# EasyEDA schematic YM2151 & STM32F0.json
TITLE: STM32F0 & YM2151; REV: 1.0.1; Date: 2020-01-29; Sheet: 1/1; Drawn By: Happeneddr9; Company: N/A
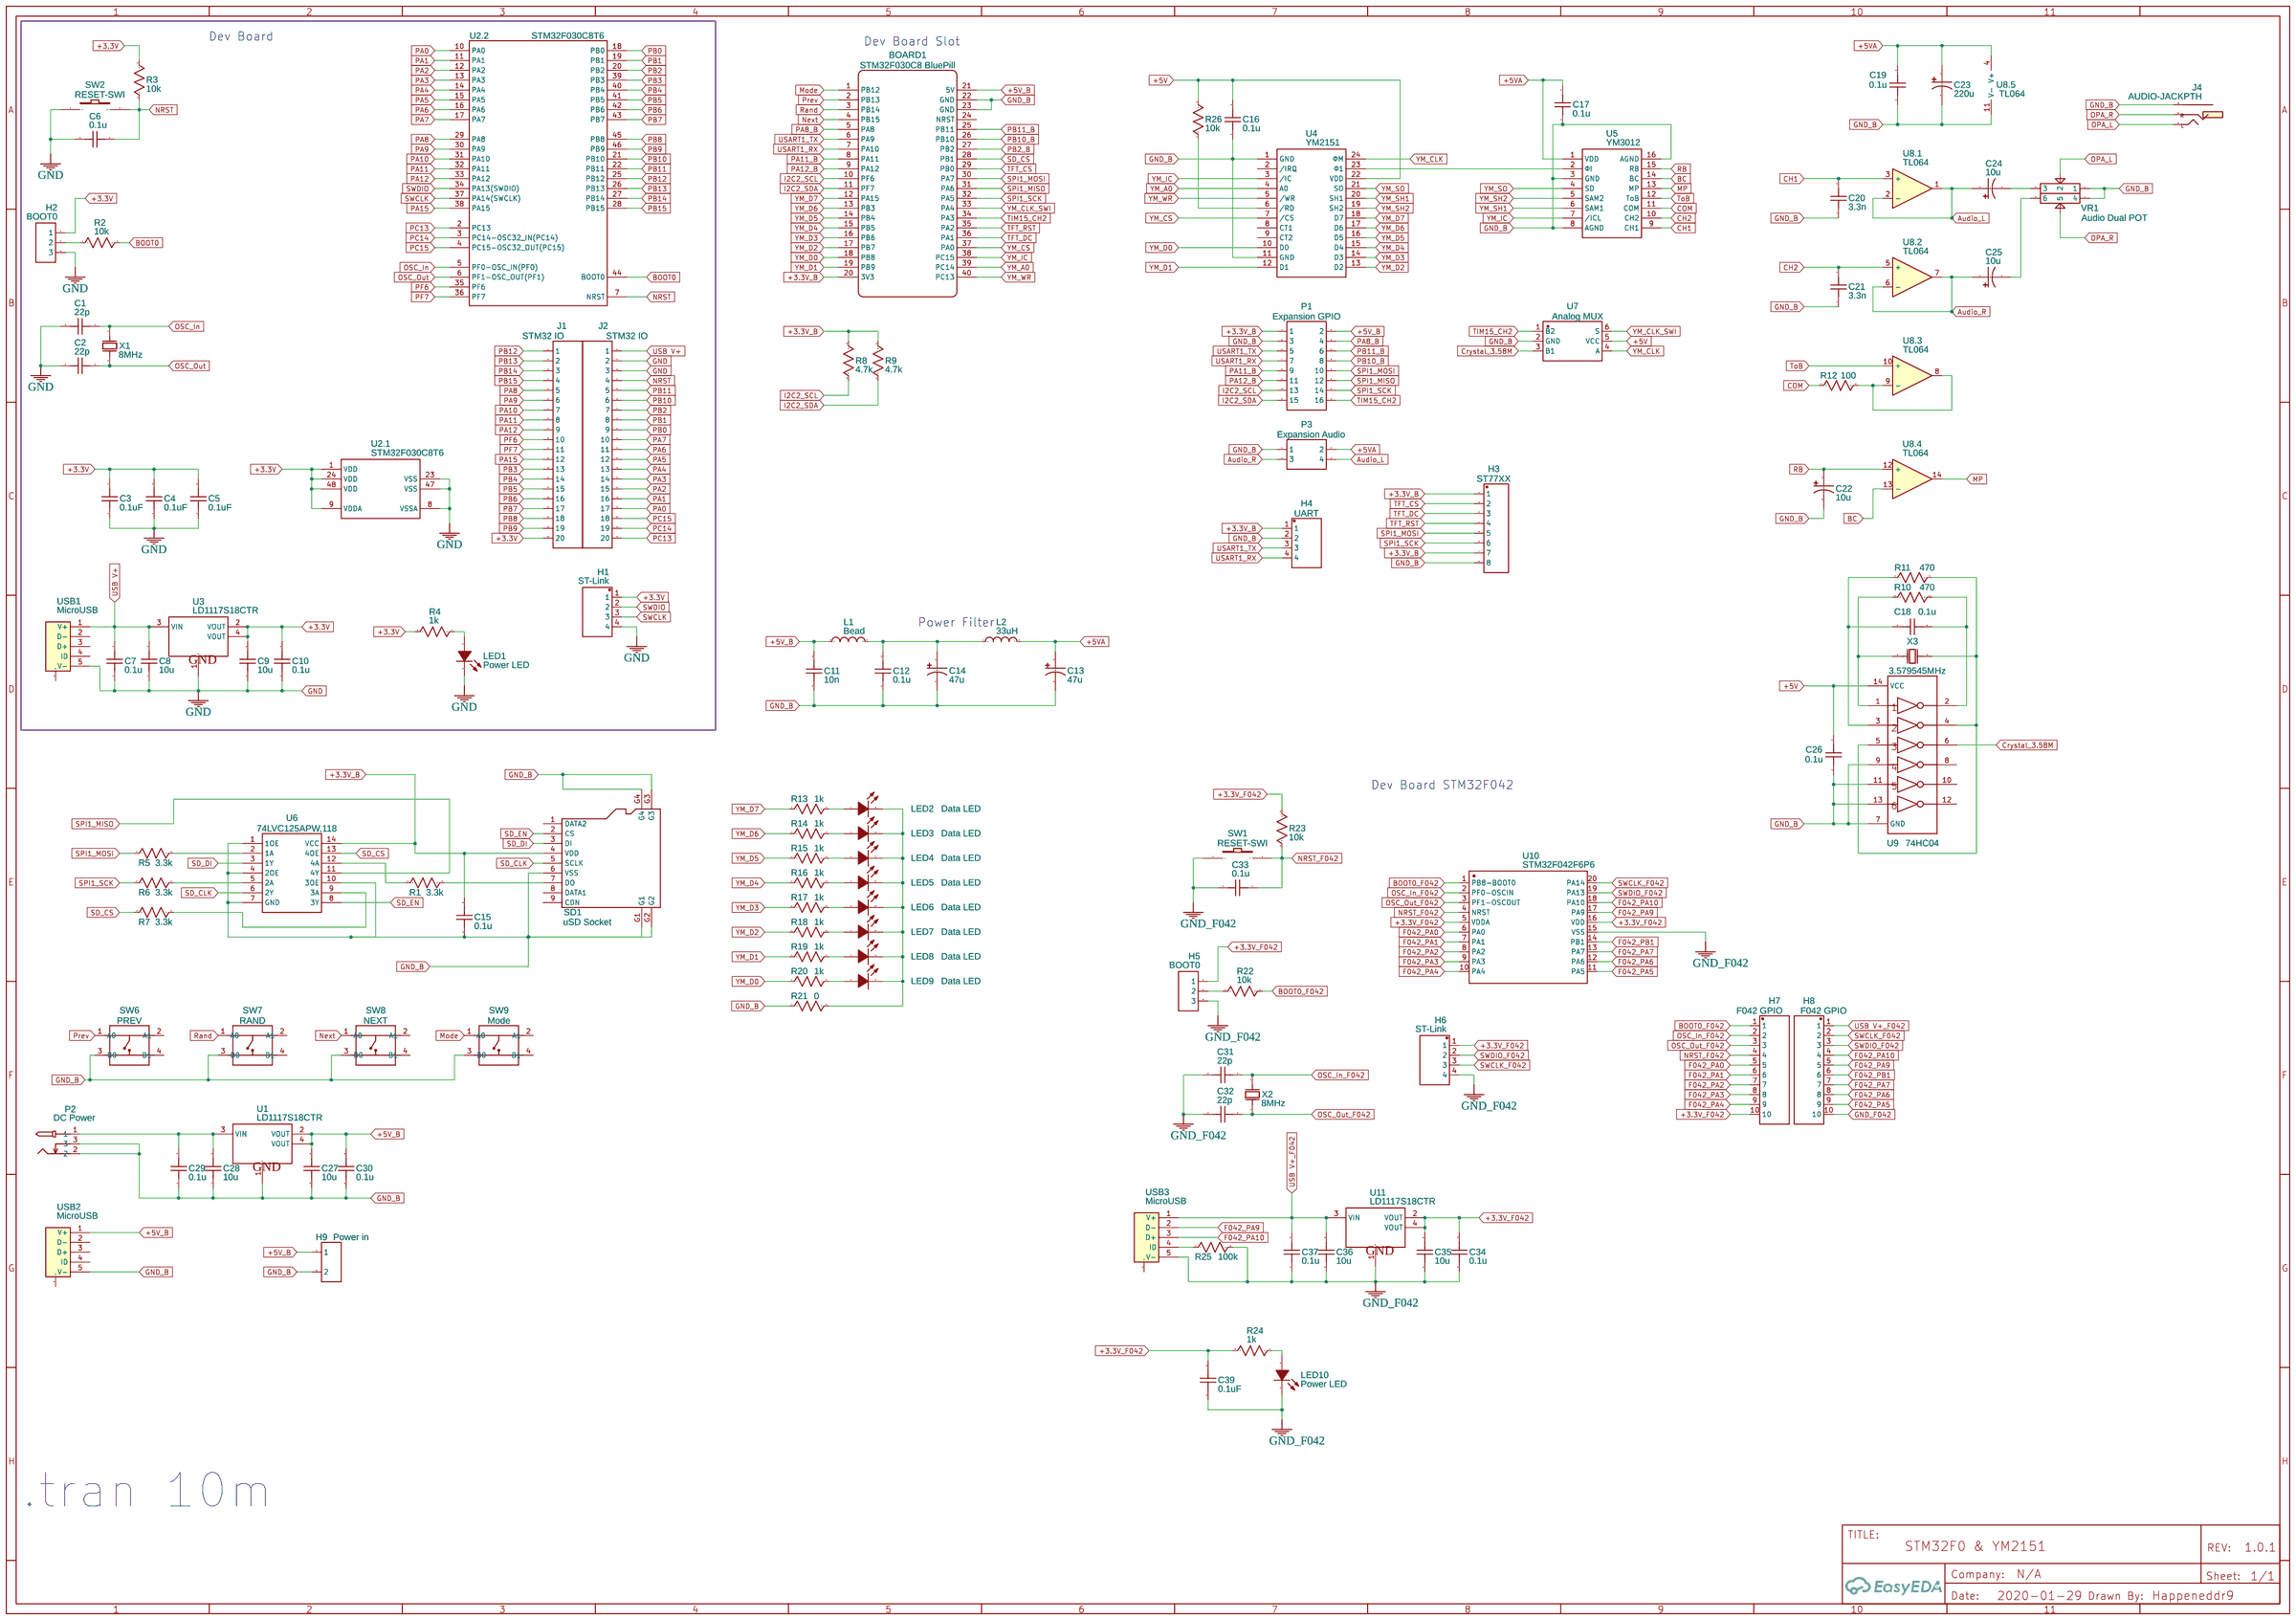
[diagram p0: schematic sheet]

## Parts
BOARD1  STM32F030C8 BluePill  [STM32F030CX_BLUEPILL-40-2.54MM]
C1  22p  [C0805]
C2  22p  [C0805]
C3  0.1uF  [C0805]
C4  0.1uF  [C0805]
C5  0.1uF  [C0805]
C6  0.1u  [C0805]
C7  0.1u  [C0805]
C8  10u  [C0805]
C9  10u  [C0805]
C10  0.1u  [C0805]
C11  10n  [C0805]
C12  0.1u  [C0805]
C13  47u  [CAP-D4.0XH5.5]
C14  47u  [CAP-D4.0XH5.5]
C15  0.1u  [0805]
C16  0.1u  [0805]
C17  0.1u  [0805]
C18  0.1u  [0805]
C19  0.1u  [0805]
C20  3.3n  [0805]
C21  3.3n  [0805]
C22  10u  [CAP-D4.0XH5.5]
C23  220u  [CAP-D5.0XH5.5]
C24  10u  [CAP-D5.0XH5.5]
C25  10u  [CAP-D5.0XH5.5]
C26  0.1u  [0805]
C27  10u  [C0805]
C28  10u  [C0805]
C29  0.1u  [C0805]
C30  0.1u  [C0805]
C31  22p  [C0805]
C32  22p  [C0805]
C33  0.1u  [C0805]
C34  0.1u  [C0805]
C35  10u  [C0805]
C36  10u  [C0805]
C37  0.1u  [C0805]
C39  0.1uF  [C0805]
H1  ST-Link  [DIP-1X4P-2.54MM-M]
H2  BOOT0  [HDR-TH_3P-P2.54-V]
H3  ST77XX  [210S-1X8P]
H4  UART  [DIP-1X4P-2.54MM-M]
H5  BOOT0  [HDR-TH_3P-P2.54-V]
H6  ST-Link  [DIP-1X4P-2.54MM-M]
H7  F042 GPIO  [210S-1X10P]
H8  F042 GPIO  [210S-1X10P]
H9  Power in  [HDR-2X1/2.54]
J1  STM32 IO  [HDR-TH_20PIN-V-MALE-PITCH2.54]
J2  STM32 IO  [HDR-TH_20PIN-V-MALE-PITCH2.54]
J4  AUDIO-JACKPTH  [AUDIO-JACK]
L1  Bead  [L1206]
L2  33uH  [IND-SMD_L7.5-W6.6]
LED1  Power LED  [LED-0805]
LED2  Data LED  [LED-0805]
LED3  Data LED  [LED-0805]
LED4  Data LED  [LED-0805]
LED5  Data LED  [LED-0805]
LED6  Data LED  [LED-0805]
LED7  Data LED  [LED-0805]
LED8  Data LED  [LED-0805]
LED9  Data LED  [LED-0805]
LED10  Power LED  [LED-0805]
P1  Expansion GPIO  [HDR-8X2/2.54]
P2  DC Power  [DC005-2.5MM]
P3  Expansion Audio  [HDR-TH_4PIN-V-ROW2-COL2-MALE-PITCH2.54]
R1  3.3k  [0805]
R2  10k  [R0805]
R3  10k  [R0805]
R4  1k  [R0805]
R5  3.3k  [0805]
R6  3.3k  [0805]
R7  3.3k  [0805]
R8  4.7k  [0805]
R9  4.7k  [0805]
R10  470  [0805]
R11  470  [0805]
R12  100  [0805]
R13  1k  [0805]
R14  1k  [0805]
R15  1k  [0805]
R16  1k  [0805]
R17  1k  [0805]
R18  1k  [0805]
R19  1k  [0805]
R20  1k  [0805]
R21  0  [0805]
R22  10k  [R0805]
R23  10k  [R0805]
R24  1k  [R0805]
R25  100k  [0805]
R26  10k  [0805]
SD1  uSD Socket  [MICRO-SD9+4P-SMD-16.1X14.5X1.85MM]
SW1  RESET-SWI  [SWITCH-3X6X2.5_SMD]
SW2  RESET-SWI  [SWITCH-3X6X2.5_SMD]
SW6  PREV  [SW4-SMD-4.5-6.0X6.0X7.5MM]
SW7  RAND  [SW4-SMD-4.5-6.0X6.0X7.5MM]
SW8  NEXT  [SW4-SMD-4.5-6.0X6.0X7.5MM]
SW9  Mode  [SW4-SMD-4.5-6.0X6.0X7.5MM]
U1  LD1117S18CTR  [SOT-223]
U2  STM32F030C8T6  [STM-LQFP48]  (sections 1,2)
U3  LD1117S18CTR  [SOT-223]
U4  YM2151  [DIP-24_24PIN-LS15.24-L31.00-W13.00-PITCH2.54]
U5  YM3012  [DIP-16_L20.0-W6.4-P2.54-LS7.6-BL]
U6  74LVC125APW,118  [TSSOP-14]
U7  Analog MUX  [SC-70-6(SOT-363)]
U8  TL064  [DIP-14_L19.2-W6.6-P2.54-LS10.9-BL]  (sections 1,2,3,4,5)
U9  74HC04  [DIP14]
U10  STM32F042F6P6  [TSSOP-20]
U11  LD1117S18CTR  [SOT-223]
USB1  MicroUSB  [MICRO-USB-1]
USB2  MicroUSB  [MICRO-USB-1]
USB3  MicroUSB  [MICRO-USB-1]
VR1  Audio Dual POT  [POTENTIOMETER AUDIO DUAL]
X1  8MHz  [HC-49US_L11.5-W4.5-P4.88]
X2  8MHz  [HC-49US_L11.5-W4.5-P4.88]
X3  3.579545MHz  [HC-49US_L11.5-W4.5-P4.88]

## Library data of the parts
BOARD1 = STM32F030C8 BluePill: Supplier: Me; Contributor: Happeneddr9
C1-C12 C27-C37 C39 = Cap_1206_US
C13 C14 C22 = Cap_Electrolytic(SMD)_D4.0XH5.5_US
C15-C21 C26 = Cap_0805_US
C23-C25 = Cap_Electrolytic(SMD)_D5.0XH5.5_US
H1 H4 H6 = Header-Male-2.54_1x4: Supplier: LCSC; Manufacturer: Ckmtw; Manufacturer Part: 210S-1*4P L=11.6MMGold-plated black; Contributor: LCSC; Supplier Part: C124378
H2 H5 = Header-Male-2.54_1x3: Supplier: LCSC; Manufacturer: BOOMELE; Manufacturer Part: Header2.54mm 1*3P; image: //image.lceda.cn/szlcsc/C49257.jpg; Supplier Part: C49257
H3 = Header-Male-2.54_1x8: Supplier: LCSC; Manufacturer: Ckmtw; Manufacturer Part: 210S-1*8P L=11.6MMGold-plated black; Contributor: LCSC; Supplier Part: C124381
H7 H8 = 210S-1*10P L=11.6MMGold-plated black: Supplier: LCSC; Manufacturer: Ckmtw; Contributor: LCSC; Supplier Part: C124372
H9 = Header-Male-2.54_1x2: Supplier: LCSC; Manufacturer: TE Connectivity; Manufacturer Part: 826629-2; image: //image.lceda.cn/szlcsc/C86471.jpg; Supplier Part: C86471
J1 J2 = Header-Male-2.54_1x20: Supplier: LCSC; Manufacturer: BOOMELE; Manufacturer Part: 2.54mm 1*20PHeader; image: //image.lceda.cn/szlcsc/C50981.jpg; Supplier Part: C50981
J4 = AUDIO-JACKPTH: 3.5mm Audio Jack
L1 = Bead: Manufacturer: Fair Rite; Manufacturer Part: 2512066017Y1; Contributor: michael murillo
L2 = GCDA0630-330MC: Supplier: LCSC; Supplier Part: C439280; Manufacturer: GLE; Contributor: LCSC
LED1-LED10 = 17-21SURC/S530-A2/TR8: Supplier: LCSC; Manufacturer: EVERLIGHT; Contributor: LCSC; Supplier Part: C131244
P1 = Header-Male-2.54_2x8: Supplier: LCSC; Manufacturer: BOOMELE; Manufacturer Part: Double row straight 2*8Headers  Pins 2.54mm; image: //image.lceda.cn/szlcsc/C68234.jpg; Supplier Part: C68234
P2 = Three-pin power interface DC005 2.5MMsocket Bagged RHOS: Supplier Part: undefined; Supplier: LCSC; Manufacturer: ReliaPro; image: http://image.lceda.cn/szlcsc/C68942.jpg
P3 = Header-Male-2.54_2x2: Supplier: LCSC; Manufacturer: BOOMELE; Manufacturer Part: Double Rows2.54mm2*2pHeaders  Pins; Supplier Part: C66690
R1 R5-R21 R25 R26 = Res_0805(1/8W)_US
R2-R4 R22-R24 = Res_1206(1/4W)_US
SD1 = MICRO-SD-CARD-SOCKET-9P(ST-TF-003A): Contributor: Felix Fricke
SW1 SW2 = SWITCH-3x6x2.5_SMD: EasyEDA: E71857; Supplier Part: E71857; Supplier: EasyEDA; Manufacturer: BBJ
SW6-SW9 = SMD-BUTTON(4P-6.0X6.0X7.5MM): Manufacturer Part: ?
U1 U3 U11 = LD1117S18CTR: Fixed Low Drop Positive Voltage Regulator, 1.8V, 4-Pin SOT-223, Tape and Reel
U2 = STM32F030C8T6: ARM Cortex-M0 32-bit MCU, 64 KB Flash, 8 KB Internal RAM, 39 IOs, 48-pin LQFP, -40 to 85 degC, Tray; subpart_no: 1
U4 = YM2151: Supplier: Me; Contributor: Happeneddr9
U5 = YM3012: Supplier: Me; Contributor: Happeneddr9
U6 = 74LVC125APW,118: Supplier Part: C6059; Supplier: LCSC; Manufacturer: Nexperia; image: //image.lceda.cn/szlcsc/C6059.jpg; Contributor: jobsonp
U7 = SN74LVC1G3157DCKR (SPDT): Supplier: LCSC; Manufacturer: TI; Manufacturer Part: SN74LVC1G3157DCKR; image: //image.lceda.cn/szlcsc/C38663.jpg; Supplier Part: C38663; LCSC Assembly: Yes; SMT Type: Extend
U8 = TL064: Contributor: Bikebreaker; subpart_no: 1
U9 = 74HC04_HEX_INVERTER: 74HC04 Hex Inverter; Contributor: SparkFun
U10 = STM32F042F6P6: Supplier Part: C81000; Supplier: LCSC; Manufacturer: STMicroelectronics
USB1-USB3 = micro USBFemale++: Supplier: LCSC; Manufacturer: ValuePro; Manufacturer Part: micro USBFemale; image: //image.lceda.cn/szlcsc/C10418.jpg; Supplier Part: C10418
VR1 = Audio Dual Gang Potensiometer: Contributor: Lumilun
X1-X3 = X49SD12MSD2SC: Supplier: LCSC; Manufacturer: YXC; Supplier Part: C16369

## Nets
+3.3V: C3.2 C4.2 C5.2 C9.2 C10.2 H1.1 H2.1 J1.20 R3.2 R4.2 U2.1(VDD) U2.9(VDDA) U2.24(VDD) U2.48(VDD) U3.2(VOUT) U3.4(VOUT)
+3.3V_B: BOARD1.20(3V3) C15.2 H3.1 H3.7 H4.1 P1.1 R8.2 R9.2 SD1.4(VDD) U6.14(VCC)
+3.3V_F042: C34.2 C35.2 C39.2 H5.1 H6.1 H7.10 R23.2 R24.2 U10.5(VDDA) U10.16(VDD) U11.2(VOUT) U11.4(VOUT)
+5V: C16.2 C26.2 R26.2 U4.22(VDD) U7.5(VCC) U9.14(VCC)
+5V_B: BOARD1.21(5V) C11.2 C27.2 C30.2 H9.1 L1.1 P1.2 U1.2(VOUT) U1.4(VOUT) USB2.1(V+)
+5VA: C13.1 C17.2 C19.2 C23.1 L2.2 P3.2 U5.1(VDD) U8.4(V+)
GND: C1.2 C2.2 C3.1 C4.1 C5.1 C6.2 C7.1 C8.1 C9.1 C10.1 H1.4 H2.3 J2.2 J2.3 LED1.2(K) SW2.1 U2.8(VSSA) U2.23(VSS) U2.47(VSS) U3.1(GND) USB1.5(V-)
GND_B: BOARD1.22(GND) BOARD1.23(GND) C11.1 C12.1 C13.2 C14.2 C15.1 C16.1 C17.1 C19.1 C20.1 C21.1 C22.2 C23.2 C26.1 C27.1 C28.1 C29.1 C30.1 H3.8 H4.2 H9.2 J4.SLEEVE P1.3 P2.2 P2.3 P3.1 R21.1 SD1.6(VSS) SD1.G1 SD1.G2 SD1.G3 SD1.G4 SW6.3(B0) SW7.3(B0) SW8.3(B0) SW9.3(B0) U1.1(GND) U4.1(GND) U4.11(GND) U5.3(GND) U5.8(AGND) U5.16(AGND) U6.1(1OE) U6.4(2OE) U6.7(GND) U6.10(3OE) U7.2(GND) U8.11(V-) U9.7(GND) U9.9(4A) U9.11(5A) U9.13(6A) USB2.5(V-) VR1.1 VR1.4
GND_F042: C31.2 C32.2 C33.2 C34.1 C35.1 C36.1 C37.1 C39.1 H5.3 H6.4 H8.10 LED10.2(K) R25.2 SW1.1 U10.15(VSS) U11.1(GND) USB3.5(V-)
Audio_L: C24.1 P3.4 U8.1 U8.2(-)
Audio_R: C25.1 P3.3 U8.6(-) U8.7
BC: U5.14(BC) U8.13(-)
BOOT0: R2.2 U2.44(BOOT0)
BOOT0_F042: H7.1 R22.2 U10.1(PB8-BOOT0)
CH1: C20.2 U5.9(CH1) U8.3(+)
CH2: C21.2 U5.10(CH2) U8.5(+)
COM: R12.1 U5.11(COM)
Crystal_3.58M: U7.3(B1) U9.6(3Y)
F042_PA0: H7.5 U10.6(PA0)
F042_PA1: H7.6 U10.7(PA1)
F042_PA2: H7.7 U10.8(PA2)
F042_PA3: H7.8 U10.9(PA3)
F042_PA4: H7.9 U10.10(PA4)
F042_PA5: H8.9 U10.11(PA5)
F042_PA6: H8.8 U10.12(PA6)
F042_PA7: H8.7 U10.13(PA7)
F042_PA9: H8.5 U10.17(PA9) USB3.2(D-)
F042_PA10: H8.4 U10.18(PA10) USB3.3(D+)
F042_PB1: H8.6 U10.14(PB1)
I2C2_SCL: BOARD1.10(PF6) P1.13 R8.1
I2C2_SDA: BOARD1.11(PF7) P1.15 R9.1
Mode: BOARD1.1(PB12) SW9.1(A0)
MP: U5.13(MP) U8.14
Next: BOARD1.4(PB15) SW8.1(A0)
NRST: C6.1 J2.4 R3.1 SW2.2 U2.7(NRST)
NRST_F042: C33.1 H7.4 R23.1 SW1.2 U10.4(NRST)
OPA_L: J4.TIP(LEFT) VR1.2
OPA_R: J4.RING(RIGHT) VR1.5
OSC_In: C1.1 U2.5(PF0-OSC_IN(PF0)) X1.1(OSC1)
OSC_In_F042: C31.1 H7.2 U10.2(PF0-OSCIN) X2.1(OSC1)
OSC_Out: C2.1 U2.6(PF1-OSC_OUT(PF1)) X1.2(OSC2)
OSC_Out_F042: C32.1 H7.3 U10.3(PF1-OSCOUT) X2.2(OSC2)
PA0: J2.17 U2.10(PA0)
PA1: J2.16 U2.11(PA1)
PA2: J2.15 U2.12(PA2)
PA3: J2.14 U2.13(PA3)
PA4: J2.13 U2.14(PA4)
PA5: J2.12 U2.15(PA5)
PA6: J2.11 U2.16(PA6)
PA7: J2.10 U2.17(PA7)
PA8: J1.5 U2.29(PA8)
PA8_B: BOARD1.5(PA8) P1.4
PA9: J1.6 U2.30(PA9)
PA10: J1.7 U2.31(PA10)
PA11: J1.8 U2.32(PA11)
PA11_B: BOARD1.8(PA11) P1.9
PA12: J1.9 U2.33(PA12)
PA12_B: BOARD1.9(PA12) P1.11
PA15: J1.12 U2.38(PA15)
PB0: J2.9 U2.18(PB0)
PB1: J2.8 U2.19(PB1)
PB2: J2.7 U2.20(PB2)
PB2_B: BOARD1.27(PB2)
PB3: J1.13 U2.39(PB3)
PB4: J1.14 U2.40(PB4)
PB5: J1.15 U2.41(PB5)
PB6: J1.16 U2.42(PB6)
PB7: J1.17 U2.43(PB7)
PB8: J1.18 U2.45(PB8)
PB9: J1.19 U2.46(PB9)
PB10: J2.6 U2.21(PB10)
PB10_B: BOARD1.26(PB10) P1.8
PB11: J2.5 U2.22(PB11)
PB11_B: BOARD1.25(PB11) P1.6
PB12: J1.1 U2.25(PB12)
PB13: J1.2 U2.26(PB13)
PB14: J1.3 U2.27(PB14)
PB15: J1.4 U2.28(PB15)
PC13: J2.20 U2.2(PC13)
PC14: J2.19 U2.3(PC14-OSC32_IN(PC14))
PC15: J2.18 U2.4(PC15-OSC32_OUT(PC15))
PF6: J1.10 U2.35(PF6)
PF7: J1.11 U2.36(PF7)
Prev: BOARD1.2(PB13) SW6.1(A0)
Rand: BOARD1.3(PB14) SW7.1(A0)
RB: C22.1 U5.15(RB) U8.12(+)
SD_CLK: SD1.5(SCLK) U6.6(2Y)
SD_CS: BOARD1.28(PB1) R7.1 U6.13(4OE)
SD_DI: SD1.3(DI) U6.3(1Y)
SD_EN: SD1.2(CS) U6.8(3Y)
SPI1_MISO: BOARD1.31(PA6) P1.12 U6.11(4Y)
SPI1_MOSI: BOARD1.30(PA7) H3.5 P1.10 R5.1
SPI1_SCK: BOARD1.32(PA5) H3.6 P1.14 R6.1
SWCLK: H1.3 U2.37(PA14(SWCLK))
SWCLK_F042: H6.3 H8.2 U10.20(PA14)
SWDIO: H1.2 U2.34(PA13(SWDIO))
SWDIO_F042: H6.2 H8.3 U10.19(PA13)
TFT_CS: BOARD1.29(PB0) H3.2
TFT_DC: BOARD1.36(PA1) H3.3
TFT_RST: BOARD1.35(PA2) H3.4
TIM15_CH2: BOARD1.34(PA3) P1.16 U7.1(B2)
ToB: U5.12(ToB) U8.10(+)
USART1_RX: BOARD1.7(PA10) H4.4 P1.7
USART1_TX: BOARD1.6(PA9) H4.3 P1.5
USB V+: C7.2 C8.2 J2.1 U3.3(VIN) USB1.1(V+)
USB V+_F042: C36.2 C37.2 H8.1 U11.3(VIN) USB3.1(V+)
YM_A0: BOARD1.39(PC14) U4.4(A0)
YM_CLK: U4.24(ΦM) U7.4(A)
YM_CLK_SWI: BOARD1.33(PA4) U7.6(S)
YM_CS: BOARD1.37(PA0) U4.7(/CS)
YM_D0: BOARD1.18(PB8) R20.1 U4.10(D0)
YM_D1: BOARD1.19(PB9) R19.1 U4.12(D1)
YM_D2: BOARD1.17(PB7) R18.1 U4.13(D2)
YM_D3: BOARD1.16(PB6) R17.1 U4.14(D3)
YM_D4: BOARD1.15(PB5) R16.1 U4.15(D4)
YM_D5: BOARD1.14(PB4) R15.1 U4.16(D5)
YM_D6: BOARD1.13(PB3) R14.1 U4.17(D6)
YM_D7: BOARD1.12(PA15) R13.1 U4.18(D7)
YM_IC: BOARD1.38(PC15) U4.3(/IC) U5.7(/ICL)
YM_SH1: U4.20(SH1) U5.6(SAM1)
YM_SH2: U4.19(SH2) U5.5(SAM2)
YM_SO: U4.21(SO) U5.4(SD)
YM_WR: BOARD1.40(PC13) U4.5(/WR)
Net-(C12-2): C12.2 C14.1 L1.2 L2.1
Net-(C18-1): C18.1 R10.2 U9.2(1Y)
Net-(C18-2): C18.2 R11.1 U9.3(2A)
Net-(C24-2): C24.2 VR1.3
Net-(C25-2): C25.2 VR1.6
Net-(C28-2): C28.2 C29.2 P2.1 U1.3(VIN)
Net-(H2-2): H2.2 R2.1
Net-(H5-2): H5.2 R22.1
Net-(LED1-1): LED1.1(A) R4.1
Net-(LED2-1): LED2.1(A) R13.2
Net-(LED2-2): LED2.2(K) LED3.2(K) LED4.2(K) LED5.2(K) LED6.2(K) LED7.2(K) LED8.2(K) LED9.2(K) R21.2
Net-(LED3-1): LED3.1(A) R14.2
Net-(LED4-1): LED4.1(A) R15.2
Net-(LED5-1): LED5.1(A) R16.2
Net-(LED6-1): LED6.1(A) R17.2
Net-(LED7-1): LED7.1(A) R18.2
Net-(LED8-1): LED8.1(A) R19.2
Net-(LED9-1): LED9.1(A) R20.2
Net-(LED10-1): LED10.1(A) R24.1
Net-(R1-1): R1.1 U6.12(4A)
Net-(R1-2): R1.2 SD1.7(DO)
Net-(R5-2): R5.2 U6.2(1A)
Net-(R6-2): R6.2 U6.5(2A)
Net-(R7-2): R7.2 U6.9(3A)
Net-(R10-1): R10.1 U9.1(1A) X3.2(OSC2)
Net-(R11-2): R11.2 U9.4(2Y) U9.5(3A) X3.1(OSC1)
Net-(R12-2): R12.2 U8.8 U8.9(-)
Net-(R25-1): R25.1 USB3.4(ID)
Net-(R26-1): R26.1 U4.6(/RD)
Net-(U4-23): U4.23(Φ1) U5.2(ΦI)

Not connected (* = marked no-connect by the designer): BOARD1 24(NRST); SD1 1(DATA2) 8(DATA1) 9(CDN); SW6 2(A1) 4(B1); SW7 2(A1) 4(B1); SW8 2(A1) 4(B1); SW9 2(A1) 4(B1); U4 2(/IRQ) 8(CT1) 9(CT2); U9 8(4Y) 10(5Y) 12(6Y); USB1 0(MTN) 2(D-) 3(D+) 4(ID); USB2 0(MTN) 2(D-) 3(D+) 4(ID); USB3 0(MTN)

## Notes on the sheet
- Dev Board
- Dev Board Slot
- Power Filter
- Dev Board STM32F042
- .tran 10m
